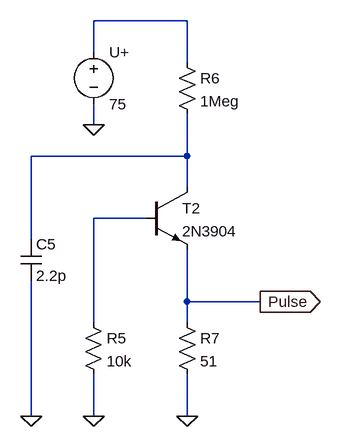
[diagram p0: schematic avalanche_pulse_gen.asc]
avalanche_pulse_gen.asc, the LTspice schematic file:
Version 4
SHEET 1 880 680
WIRE 208 -144 64 -144
WIRE 64 -96 64 -144
WIRE 208 -80 208 -144
WIRE 64 16 64 -16
WIRE 208 64 208 0
WIRE 208 64 -32 64
WIRE 208 112 208 64
WIRE 144 160 64 160
WIRE -32 192 -32 64
WIRE 208 288 208 208
WIRE 320 288 208 288
WIRE 64 320 64 160
WIRE 208 320 208 288
WIRE -32 464 -32 256
WIRE 64 464 64 400
WIRE 208 464 208 400
FLAG -32 464 0
FLAG 64 464 0
FLAG 208 464 0
FLAG 320 288 Pulse
IOPIN 320 288 Out
FLAG 64 16 0
SYMBOL npn 144 112 R0
SYMATTR InstName T2
SYMATTR Value 2N3904
SYMBOL cap -48 192 R0
SYMATTR InstName C5
SYMATTR Value 2.2p
SYMBOL res 48 304 R0
SYMATTR InstName R5
SYMATTR Value 10k
SYMBOL res 192 304 R0
SYMATTR InstName R7
SYMATTR Value 51
SYMBOL res 192 -96 R0
SYMATTR InstName R6
SYMATTR Value 1Meg
SYMBOL voltage 64 -112 R0
WINDOW 123 0 0 Left 0
WINDOW 39 0 0 Left 0
SYMATTR InstName U+
SYMATTR Value 75

The netlist it stands for:
* avalanche_pulse_gen.asc
Q§T2 N002 N003 Pulse 0 2N3904
C5 N002 0 2.2p
R5 N003 0 10k
R7 Pulse 0 51
R6 N001 N002 1Meg
V§U+ N001 0 75
.model NPN NPN
.model PNP PNP
.lib standard.bjt
.backanno
.end